# EAGLE design ConsoleSchematic (EAGLE 7.1.0)
Schematic for ATTiny85 Console
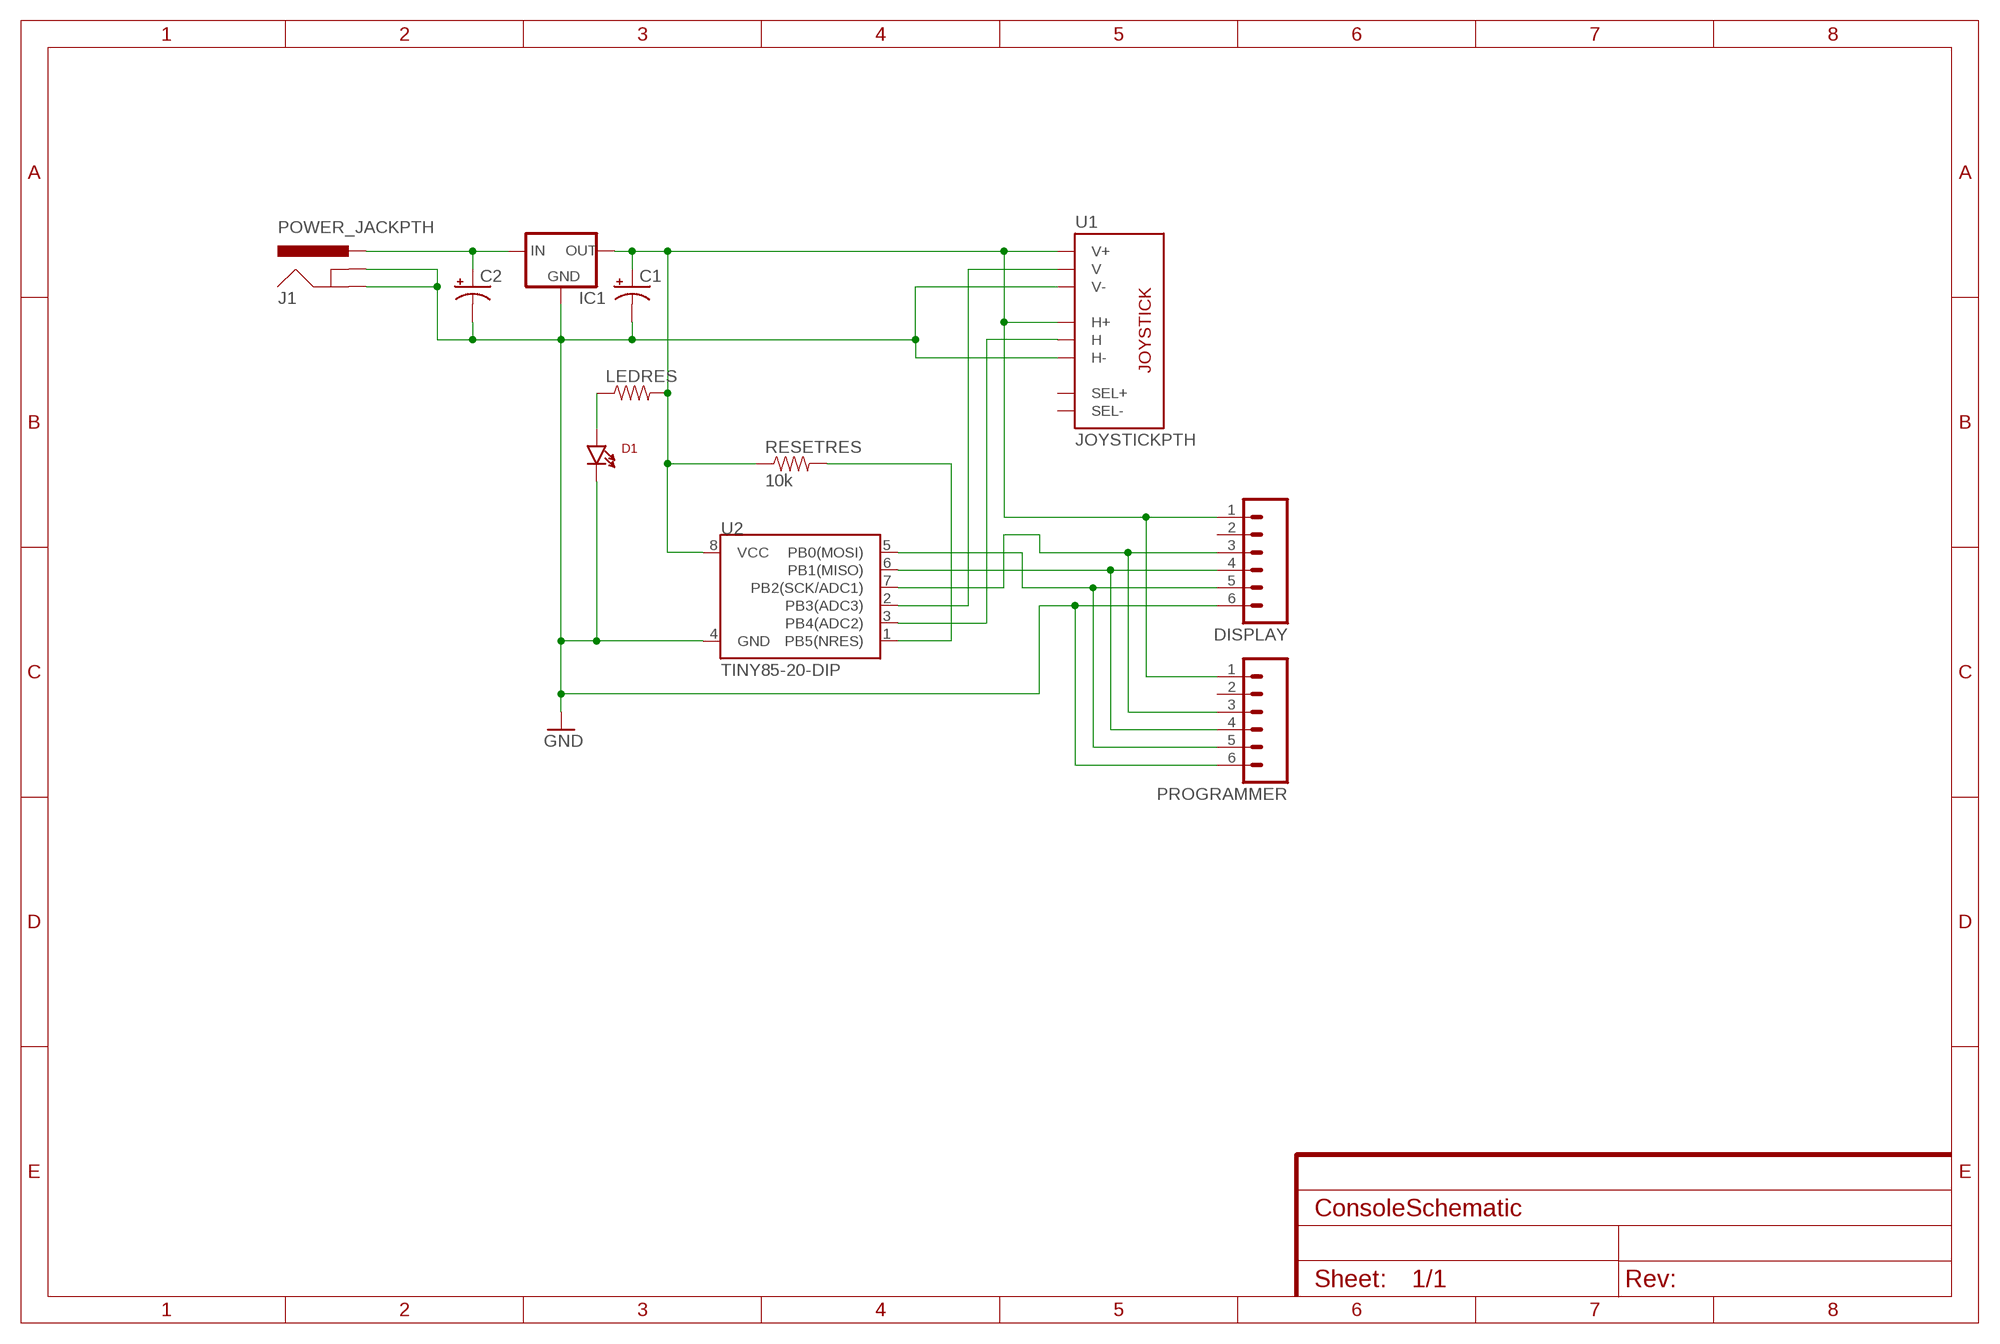
[diagram p0: schematic, sheet 1]

## Parts
C1  10UF-25V-20%(PTH)KIT  [CPOL-RADIAL-10UF-25V-KIT]
C2  10UF-25V-20%(PTH)KIT  [CPOL-RADIAL-10UF-25V-KIT]
D1  LTE-302  [LTE-302]
DISPLAY  M06SILK_FEMALE_PTH  [1X06]
IC1  V_REG_78XXSIDE  [78XXL]
J1  POWER_JACKPTH  [POWER_JACK_PTH]
LEDRES  RESISTOREZ  [AXIAL-0.3EZ]
PROGRAMMER  M06SILK_FEMALE_PTH  [1X06]
RESETRES  10k  10KOHM-1/4W-1%(PTH)HORIZ  [AXIAL-0.3]
U1  JOYSTICKPTH  [JOYSTICK]
U2  TINY85-20-DIP  ATTINY45TINY85-20-DIP  [DIP08]

## Nets
CS: DISPLAY.4 PROGRAMMER.4 U2.6(PB1(MISO))
GND: C1.2(-) C2.2(-) D1.C DISPLAY.6 IC1.GND J1.GND J1.GNDBREAK PROGRAMMER.6 U1.H3(H-) U1.V3(V-) U2.4(GND)
MOSI: DISPLAY.5 PROGRAMMER.5 U2.5(PB0(MOSI))
N$1: D1.A LEDRES.P$1
N$2: RESETRES.P$2 U2.1(PB5(NRES))
N$3: U1.V2(V) U2.2(PB3(ADC3))
N$4: U1.H2(H) U2.3(PB4(ADC2))
N$10: C2.1(+) IC1.IN J1.PWR
SCK: DISPLAY.3 PROGRAMMER.3 U2.7(PB2(SCK/ADC1))
VCC: C1.1(+) DISPLAY.1 IC1.OUT LEDRES.P$2 PROGRAMMER.1 RESETRES.P$1 U1.H1(H+) U1.V1(V+) U2.8(VCC)
Unconnected: DISPLAY.2 PROGRAMMER.2 U1.B1A(SEL+) U1.B2A(SEL-)

## Library data of the parts
C1 C2 = SparkFun-Capacitors:10UF-25V-20%(PTH): CAP-08440; PROD_ID: CAP-08440
D1 = SparkFun-LED:LTE-302: Through-hole side-firing 940nm IR LED
DISPLAY PROGRAMMER = SparkFun-Connectors:M06: Header 6 Standard 6-pin 0.1" header. Use with straight break away headers (SKU : PRT-00116), right angle break away headers (PRT-00553), swiss pins (PRT-00743), machine pins (PRT-00117), and female headers (PRT-00115). Molex polarized connector foot print use with SKU : PRT-08094 with associated crimp pins and housings. NOTES ON THE VARIANTS LOCK and LOCK_LONGPADS... This footprint was designed to help hold the alignment of a through-hole component (i.e. 6-pin header) while soldering it into place. You may notice that each hole has been shifted either up or down by 0.005 of an inch from it's more standard position (which is a perfectly straight line). This slight alteration caused the pins (the squares in the middle) to touch the edges of the holes. Because they are alternating, it causes a "brace" to hold the component in place. 0.005 has proven to be the perfect amount of "off-center" position when using our standard breakaway headers. Although looks a little odd when you look at the bare footprint, once you have a header in there, the alteration is very hard to notice. Also,if you push a header all the way into place, it is covered up entirely on the bottom side. This idea of altering the position of holes to aid alignment will be further integrated into the Sparkfun Library for other footprints. It can help hold any component with 3 or more connection pins.; PROD_ID: CONN-08437
IC1 = SparkFun-PowerIC:V_REG_78XX: Voltage Regulator Standard 7805 5V regulator. IGO (Input Ground Output). Spark Fun Electronics SKU : COM-00107
J1 = SparkFun-Connectors:POWER_JACK: Power Jack This is the standard 5.5mm barrel jack for power. The PTH is the most common, proven, reliable, footprint. The Slot footprint only works if the mill layer is transmitted to the PCB fab house so be warned. Mating wall wart : TOL-00298 (and others); PROD_ID: CONN-08197
LEDRES = SparkFun-Passives:RESISTOR: Resistor Basic schematic elements and footprints for 0603, 1206, and PTH resistors.
RESETRES = SparkFun-Resistors:10KOHM-1/4W-1%(PTH): RES-12183; PROD_ID: RES-12183
U1 = SparkFun-Electromechanical:JOYSTICK: Thumb Joystick Joystick commonly found in PS2 controllers. Two pots and a select switch. Footprint proven. Spark Fun Electronics SKU : COM-09032
U2 = SparkFun-DigitalIC:ATTINY45: Atmel 8-pin 2/4/8kB flash uC; PROD_ID: IC-09445

## Board
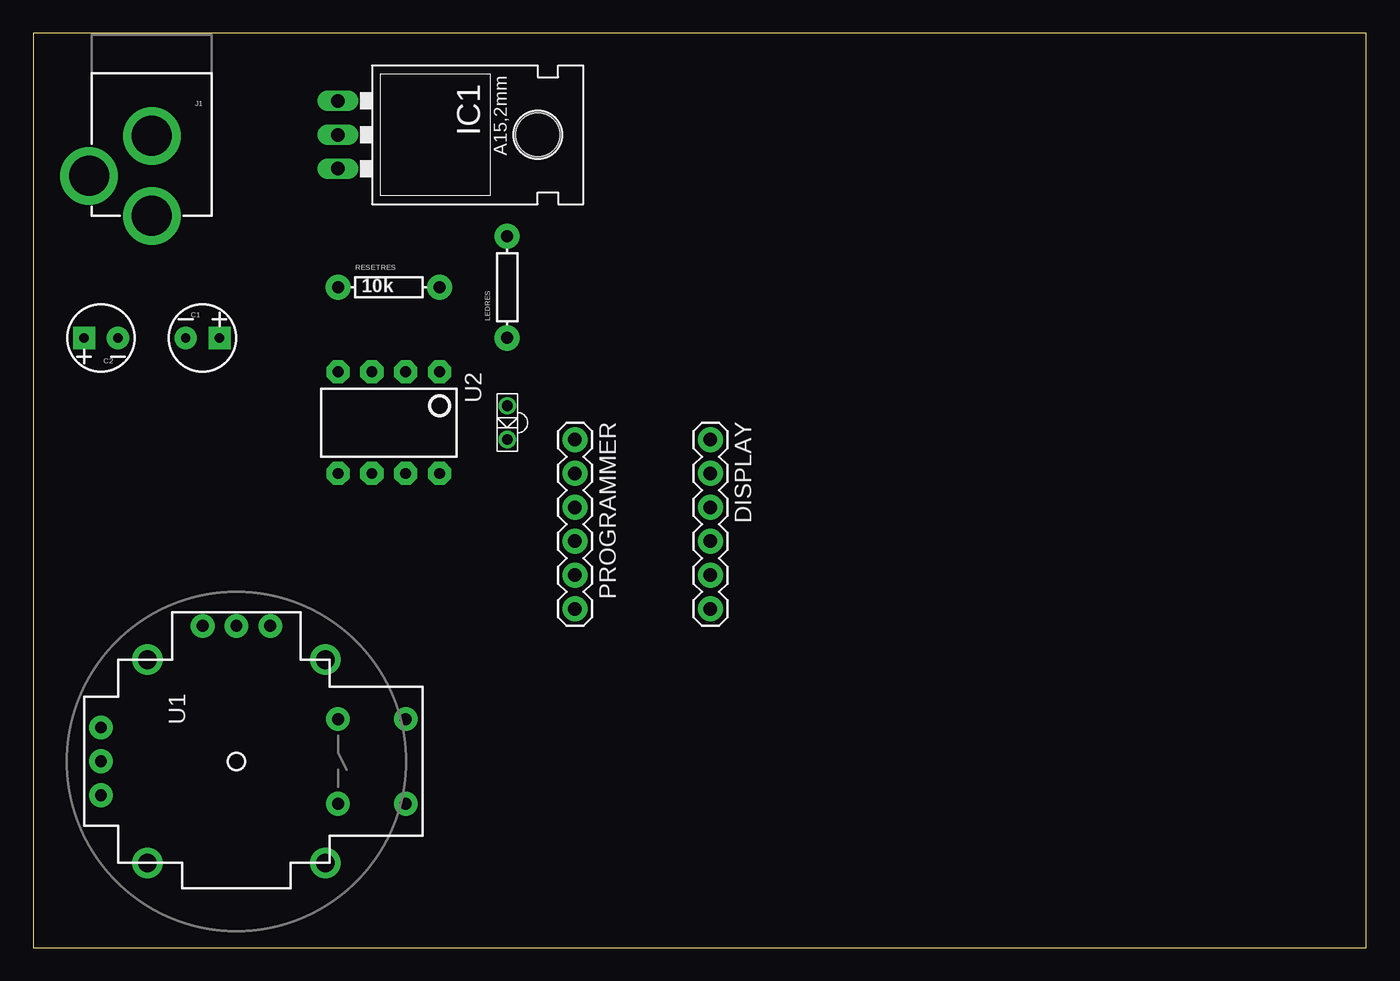
[diagram p1: board, top side]
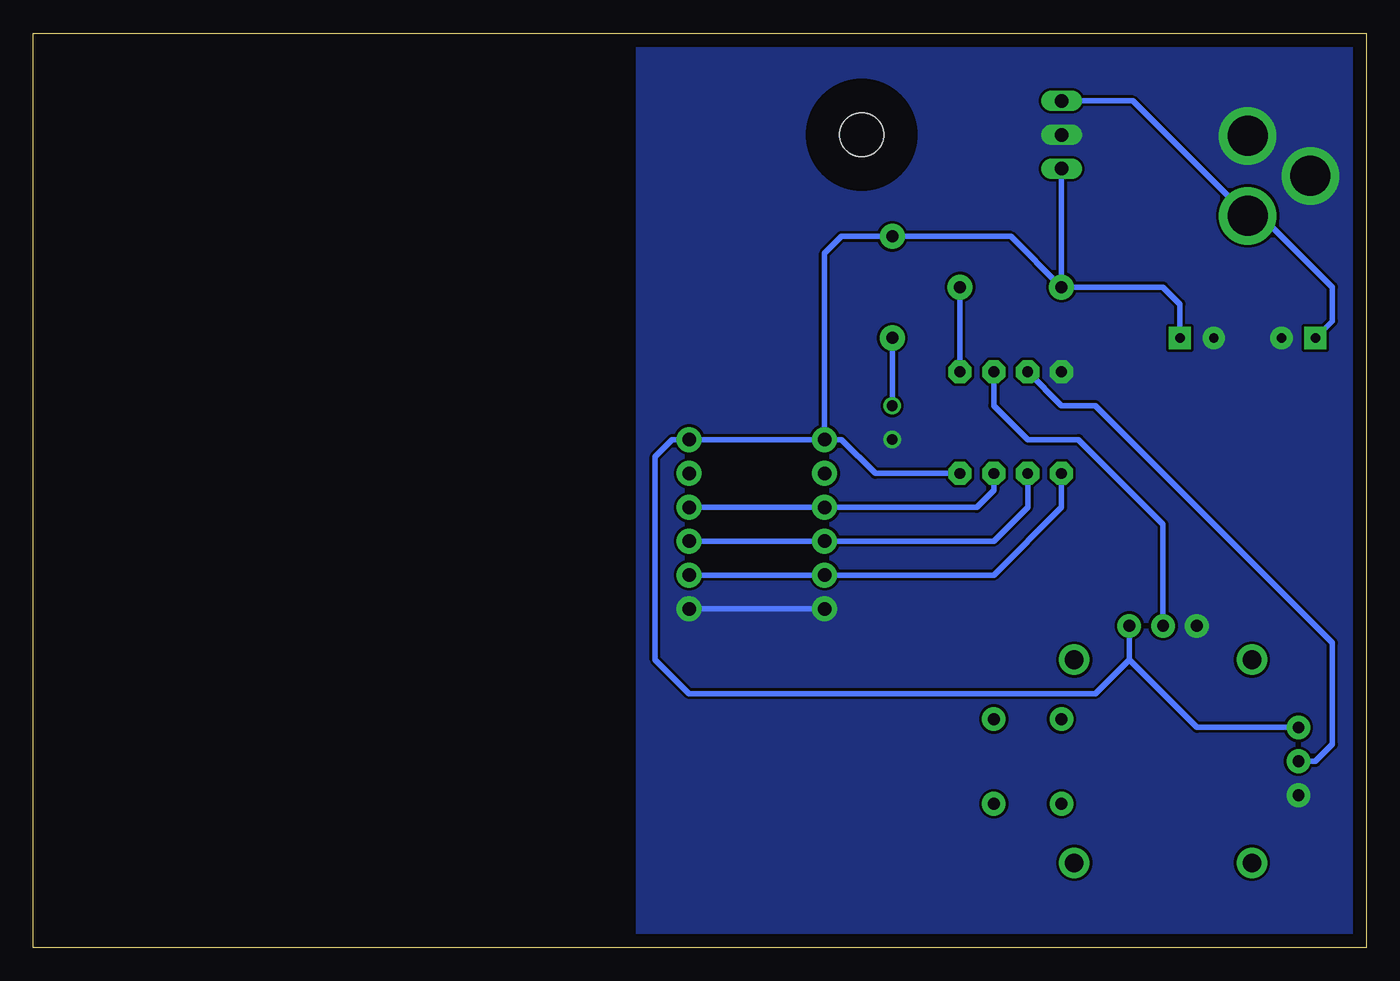
[diagram p2: board, bottom side, seen from below]

Size 100 x 68.57 mm. Coordinates in mm from the lower left corner, seen from the top.
Outline: 0,0 100,0 100,68.57 0,68.57 0,0
Copper layers (1*16): Top 0.035mm / dielectric 1.5mm / Bottom 0.035mm
Design rules "default": minimum track width 10mil, minimum drill 24mil, track to track 8mil, track to pad 8mil, pad to pad 8mil, via to via 8mil, smd to smd 8mil, copper to edge 40mil, drill to drill 8mil, minimum pad ring 10mil, minimum via ring 8mil, stop-mask expansion 4mil, vias tented up to drill 0mil, thermal gap 10mil

### Footprints (pad centres in the part's own frame; a part is rotated, then mirrored left to right if it is on the bottom)
CPOL-RADIAL-10UF-25V-KIT = drill 0.7 pad 1.651 square: 1 1.27,0 | drill 0.7 pad 1.651: 2 -1.27,0
LTE-302 = drill 0.8: A 1.27,0; C -1.27,0
1X06 = drill 1.016 pad 1.88: 1 0,0; 2 2.54,0; 3 5.08,0; 4 7.62,0; 5 10.16,0; 6 12.7,0
78XXL = drill 1.016 long: GND 0,-3.81; IN -2.54,-3.81; OUT 2.54,-3.81 | hole 3.302: 0,11.176
POWER_JACK_PTH = drill 2.997 pad 4.318: GND 0,7.7; GNDBREAK 4.7,10.7; PWR 0,13.7
AXIAL-0.3EZ = drill 0.9 pad 1.88: P$1 -3.81,0; P$2 3.81,0
AXIAL-0.3 = drill 0.9 pad 1.88: P$1 -3.81,0; P$2 3.81,0
JOYSTICK = drill 0.9 pad 1.778: B1A -3.175,12.7; B1B 3.175,12.7; B2A -3.175,7.62; B2B 3.175,7.62 | drill 0.889 pad 1.778: H1 -2.54,-10.16; H2 0,-10.16; H3 2.54,-10.16; V1 -10.16,2.54; V2 -10.16,0; V3 -10.16,-2.54 | drill 1.397 pad 2.286: MOUNT1 -7.62,6.668; MOUNT2 -7.62,-6.668; MOUNT3 7.62,-6.668; MOUNT4 7.62,6.668
DIP08 = drill 0.813 pad 1.727 octagon: 1 -3.81,-3.81; 2 -1.27,-3.81; 3 1.27,-3.81; 4 3.81,-3.81; 5 3.81,3.81; 6 1.27,3.81; 7 -1.27,3.81; 8 -3.81,3.81

### Placement (x,y rotation side)
C1  12.7,45.72 0 top
C2  5.08,45.72 180 top
D1  35.56,39.37 90 top
DISPLAY  50.8,38.1 270 top
IC1  26.67,60.96 270 top
J1  8.89,68.58 180 top
LEDRES  35.56,49.53 90 top
PROGRAMMER  40.64,38.1 270 top
RESETRES  26.67,49.53 0 top
U1  15.24,13.97 270 top
U2  26.67,39.37 180 top

### Tracks (layer width: path | path; a pad name or v marks a point on that pad's centre or on a via)
CS
  Bottom 0.406: U2.6 25.4,33.02 27.94,30.48 PROGRAMMER.4 DISPLAY.4
GND
  Bottom 0.406: PROGRAMMER.6 DISPLAY.6
  pour Bottom (rank 6, no thermals): 0,68.58 54.61,68.58 54.61,0 0,0
MOSI
  Bottom 0.406: U2.5 22.86,33.02 27.94,27.94 PROGRAMMER.5 DISPLAY.5
N$1
  Bottom 0.406: LEDRES.P$1 D1.A
N$2
  Bottom 0.406: U2.1 RESETRES.P$2
N$3
  Bottom 0.406: U2.2 27.94,40.64 25.4,38.1 21.59,38.1 15.24,31.75 U1.V2
N$4
  Bottom 0.406: U1.H2 3.81,13.97 2.54,15.24 2.54,22.86 20.32,40.64 22.86,40.64 U2.3
N$10
  Bottom 0.406: C2.1 2.54,46.99 2.54,49.53 7.89,54.88 J1.PWR 17.51,63.5 IC1.IN
SCK
  Bottom 0.406: U2.7 27.94,34.29 29.21,33.02 PROGRAMMER.3 DISPLAY.3
VCC
  Bottom 0.406: IC1.OUT RESETRES.P$1 | U1.H1 12.7,16.51 17.78,21.59 | C1.1 13.97,48.26 15.24,49.53 RESETRES.P$1 | RESETRES.P$1 26.67,53.34 LEDRES.P$2 39.37,53.34 40.64,52.07 PROGRAMMER.1 | PROGRAMMER.1 DISPLAY.1 52.07,38.1 53.34,36.83 53.34,21.59 50.8,19.05 20.32,19.05 17.78,21.59 | U2.8 36.83,35.56 39.37,38.1 PROGRAMMER.1 | U1.V1 17.78,21.59